# EAGLE design Logic Engine - AVR (EAGLE 7.4.0)
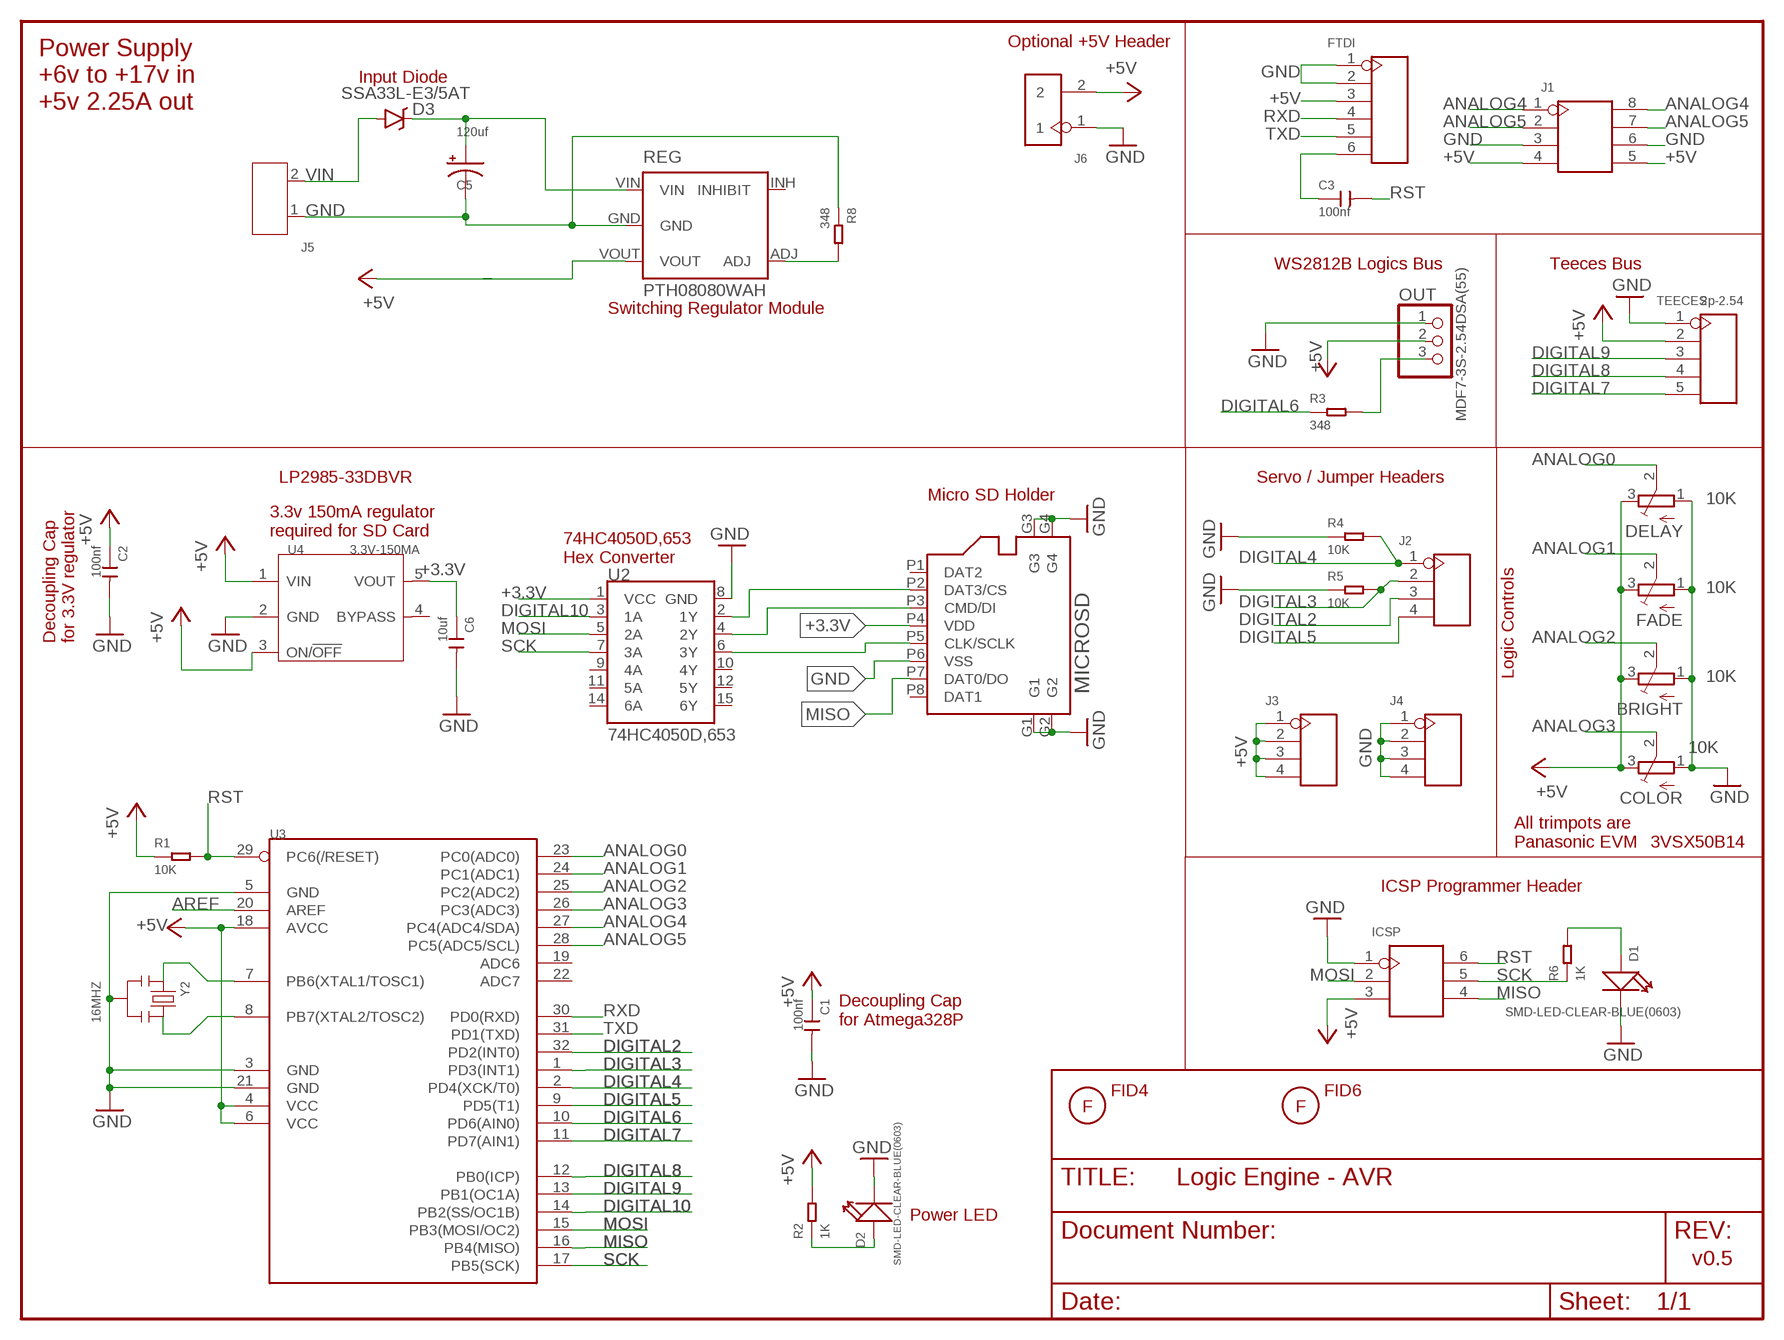
[diagram p0: schematic, sheet 1]

## Parts
BRIGHT  10K  TRIMPOTEVM3V  [EVM3V]
C1  100nf  CERAMIC-100NF-50V-10%-X7R(0805)  [C0805]
C2  100nf  CERAMIC-100NF-50V-10%-X7R(0805)  [C0805]
C3  100nf  CERAMIC-100NF-50V-10%-X7R(0805)  [C0805]
C5  120uf  CPOL-USD  [PANASONIC_D]
C6  10uf  CERAMIC-10UF-25V-10%-X5R(0805)  [C0805]
COLOR  10K  TRIMPOTEVM3V  [EVM3V]
D1  SMD-LED-CLEAR-BLUE(0603)  [LED-0603]
D2  SMD-LED-CLEAR-BLUE(0603)  [LED-0603]
D3  SSA33L-E3/5AT  B340A  [SMA-DIODE]
DELAY  10K  TRIMPOTEVM3V  [EVM3V]
FADE  10K  TRIMPOTEVM3V  [EVM3V]
FID4  FIDUCIAL  [FIDUCIAL_G15]
FID6  FIDUCIAL  [FIDUCIAL_G15]
FTDI  DIP-BLACK-MALE-HEADER(6P-2.54)  [H6-2.54]
ICSP  DIP-BLACK-MALE-HEADER(2X3P-2.54）-2.54  [H2X3-2.54]
J1  DIP-BLACK-MALE-HEADER-VERT(2X4P-2.54)  [H2X4-2.54]
J2  DIP-BLACK-MALE-HEADER-VERT(4P-2.54)  [H4-2.54]
J3  DIP-BLACK-MALE-HEADER-VERT(4P-2.54)  [H4-2.54]
J4  DIP-BLACK-MALE-HEADER-VERT(4P-2.54)  [H4-2.54]
J5  SCREW-TERMINAL-GREEN(2P-3.5)  [H2-3.5-7.0X7.0MM]
J6  DIP-BLACK-MALE-HEADER-VERT(2P-2.54)  [H2-2.54]
MICROSD  MICROSD47579-001  [SD-47579-001]
OUT  MDF7-3S-2.54DSA(55)  MDF7-1X3  [MDF7_1X03]
R1  10K  RES-0603  [R0603]
R2  1K  RES-0603  [R0603]
R3  348  RES-0603  [R0603]
R4  10K  RES-0603  [R0603]
R5  10K  RES-0603  [R0603]
R6  1K  RES-0603  [R0603]
R8  348  RES-0603  [R0603]
REG  PTH08080WAH  PTH08080WPTH08080W_TH  [PTH08080W_TH]
TEECES  2p-2.54  DIP-BLACK-MALE-HEADER-VERT(5P-2.54)  [H5-2.54]
U2  74HC4050D,653  HEX_CONVERTER  [SO016]
U3  MCU-ATMEGA328P-AU(TQFP32)  [TQFP32-0.8-7X7MM]
U4  3.3V-150MA  PMIC-LP2985-50DBVR(SOT23-5)  [SOT-23-5]
Y2  16MHZ  SMD-RESONATOR-16MHZ-15PF-0.5%-40R(3P-3.2X1.3MM)  [X3-SMD-3.6X1.3X0.8MM]

## Nets
+3.3V: C6.1 MICROSD.P4(VDD) U2.1(VCC) U4.5(VOUT)
+5V [supply]: BRIGHT.3(E) C1.1 C2.1 COLOR.3(E) DELAY.3(E) FADE.3(E) FTDI.3 ICSP.3 J1.4 J1.5 J3.1 J3.2 J3.3 J3.4 J6.2 OUT.2 R1.1 R2.2 REG.VOUT TEECES.2 U3.4(VCC) U3.6(VCC) U3.18(AVCC) U4.1(VIN) U4.3(ON/!OFF)
ANALOG0: DELAY.2(S) U3.23(PC0(ADC0))
ANALOG1: FADE.2(S) U3.24(PC1(ADC1))
ANALOG2: BRIGHT.2(S) U3.25(PC2(ADC2))
ANALOG3: COLOR.2(S) U3.26(PC3(ADC3))
ANALOG4: J1.1 J1.8 U3.27(PC4(ADC4/SDA))
ANALOG5: J1.2 J1.7 U3.28(PC5(ADC5/SCL))
AREF: U3.20(AREF)
CS: MICROSD.P2(DAT3/CS) U2.2(1Y)
DATA_IN: MICROSD.P3(CMD/DI) U2.4(2Y)
DIGITAL2: J2.3 U3.32(PD2(INT0))
DIGITAL3: J2.2 R5.2 U3.1(PD3(INT1))
DIGITAL4: J2.1 R4.2 U3.2(PD4(XCK/T0))
DIGITAL5: J2.4 U3.9(PD5(T1))
DIGITAL6 [LED_out]: R3.1 U3.10(PD6(AIN0))
DIGITAL7: TEECES.5 U3.11(PD7(AIN1))
DIGITAL8: TEECES.4 U3.12(PB0(ICP))
DIGITAL9: TEECES.3 U3.13(PB1(OC1A))
DIGITAL10: U2.3(1A) U3.14(PB2(SS/OC1B))
GND [beefyPower]: BRIGHT.1(A) C1.2 C2.2 C5.- C6.2 COLOR.1(A) D1.- D2.- DELAY.1(A) FADE.1(A) FTDI.1 FTDI.2 ICSP.1 J1.3 J1.6 J4.1 J4.2 J4.3 J4.4 J5.1 J6.1 MICROSD.G1 MICROSD.G2 MICROSD.G3 MICROSD.G4 MICROSD.P6(VSS) OUT.1 R4.1 R5.1 R8.1 REG.GND TEECES.1 U2.8(GND) U3.3(GND) U3.5(GND) U3.21(GND) U4.2(GND) Y2.2
MISO: ICSP.4 MICROSD.P7(DAT0/DO) U3.16(PB4(MISO))
MOSI: ICSP.2 U2.5(2A) U3.15(PB3(MOSI/OC2))
N$3 [beefyPower]: C5.+ D3.C REG.VIN
N$4: D1.+ R6.2
N$5 [supply]: D2.+ R2.1
N$6: R8.2 REG.ADJ
N$7: OUT.3 R3.2
N$9: U3.7(PB6(XTAL1/TOSC1)) Y2.1
N$10: U3.8(PB7(XTAL2/TOSC2)) Y2.3
RST: C3.2 ICSP.6 R1.2 U3.29(PC6(/RESET))
RTS#: C3.1 FTDI.6
RXD: FTDI.4 U3.30(PD0(RXD))
SCK: ICSP.5 R6.1 U2.7(3A) U3.17(PB5(SCK))
SCLK: MICROSD.P5(CLK/SCLK) U2.6(3Y)
TXD: FTDI.5 U3.31(PD1(TXD))
VIN [beefyPower]: D3.A J5.2
Unconnected: MICROSD.P1(DAT2) MICROSD.P8(DAT1) REG.INH(INHIBIT) U2.9(4A) U2.10(4Y) U2.11(5A) U2.12(5Y) U2.14(6A) U2.15(6Y) U3.19(ADC6) U3.22(ADC7) U4.4(BYPASS)

## Notes on the sheet
- Optional +5V Header
- Input Diode
- Power Supply
  +6v to +17v in
  +5v 2.25A out
- WS2812B Logics Bus | Teeces Bus
- Switching Regulator Module
- LP2985-33DBVR | Servo / Jumper Headers
- Micro SD Holder
- 3.3v 150mA regulator
  required for SD Card
- 74HC4050D,653
  Hex Converter
- Decoupling Cap
  for 3.3V regulator
- Logic Controls
- All trimpots are
  Panasonic EVM‑3VSX50B14
- ICSP Programmer Header
- Decoupling Cap
  for Atmega328P
- Power LED
- v0.5

## Library data of the parts
BRIGHT COLOR DELAY FADE = rseries:TRIMPOT: Panasonic SMT trimmer potentiometer part number EVM3V http://industrial.panasonic.com/www-data/pdf/AOI0000/AOI0000CE4.pdf
C1-C3 = Seeed-OPL-Capacitor:CERAMIC-100NF-50V-10%-X7R(0805): 302010165; MPN: CC0805KRX7R9BB104
C5 = rseries:CPOL-US: POLARIZED CAPACITOR, American symbol
C6 = Seeed-OPL-Capacitor:CERAMIC-10UF-25V-10%-X5R(0805): 302010178; MPN: CC0805KKX5R8BB106
D1 D2 = OPL-Diode:SMD-LED-CLEAR-BLUE(0603): 304090045; MPN: 19-217-BHC-ZL1M2RY-3T
D3 = SparkFun-DiscreteSemi:B340A: Schottky Diode 3A-40V; PROD_ID: DIO-09886; VALUE: BA340A
FID4 FID6 = SmallBatchLibPre1:FIDUCIAL
FTDI = Seeed-OPL-Connector:DIP-BLACK-MALE-HEADER(6P-2.54): 320020078; MPN: P125-1106A1BS116A1
ICSP = Seeed-OPL-Connector:DIP-BLACK-MALE-HEADER(2X3P-2.54）: 320020077; MPN: P125-12A1BS116A1
J1 = OPL-Connector:DIP-BLACK-MALE-HEADER-VERT(2X4P-2.54): 320020029; MPN: P125-1208A0BS116A2
J2-J4 = OPL-Connector:DIP-BLACK-MALE-HEADER-VERT(4P-2.54): 320020017; MPN: P125-1104A0BS116A1
J5 = OPL-Connector:SCREW-TERMINAL-GREEN(2P-3.5): 320110028
J6 = OPL-Connector:DIP-BLACK-MALE-HEADER-VERT(2P-2.54): 320020016; MPN: P125-1102A0BS116A1
MICROSD = rseries:MICROSD: Micro-SD / Transflash card holder with SPI pinout For the Molex 0473093751 small-footprint MicroSD holder.
OUT = rseries:MDF7-1X3: MDF7 Bottom Entry Receptacle
R1 R2 R4-R6 = OPL-Resistor:RES
R3 R8 = Seeed-OPL-Resistor:RES
REG = rseries:PTH08080W
TEECES = Seeed-OPL-Connector:DIP-BLACK-MALE-HEADER-VERT(5P-2.54): 320020040
U2 = SparkFun-DigitalIC:HEX_CONVERTER: Just what it says.
U3 = Seeed-OPL-ic:MCU-ATMEGA328P-AU(TQFP32): 310010049; MPN: ATMEGA328P-AU
U4 = Seeed-OPL-ic:PMIC-LP2985-50DBVR(SOT23-5): 310030254; MPN: LP2985-33DBVR; VALUE: 5V-150MA
Y2 = Seeed-OPL-crystal-osctllator:SMD-RESONATOR-16MHZ-15PF-0.5%-40R(3P-3.2X1.3MM): 306030002; MPN: CSTCE16M0V53-R0

## Net classes
1 supply: width 0.305 mm, drill 0.152 mm, clearance 0.203 mm
2 LED_out: width 0.305 mm, clearance 0.229 mm
3 beefyPower: width 1.676 mm, clearance 0.33 mm

## Board
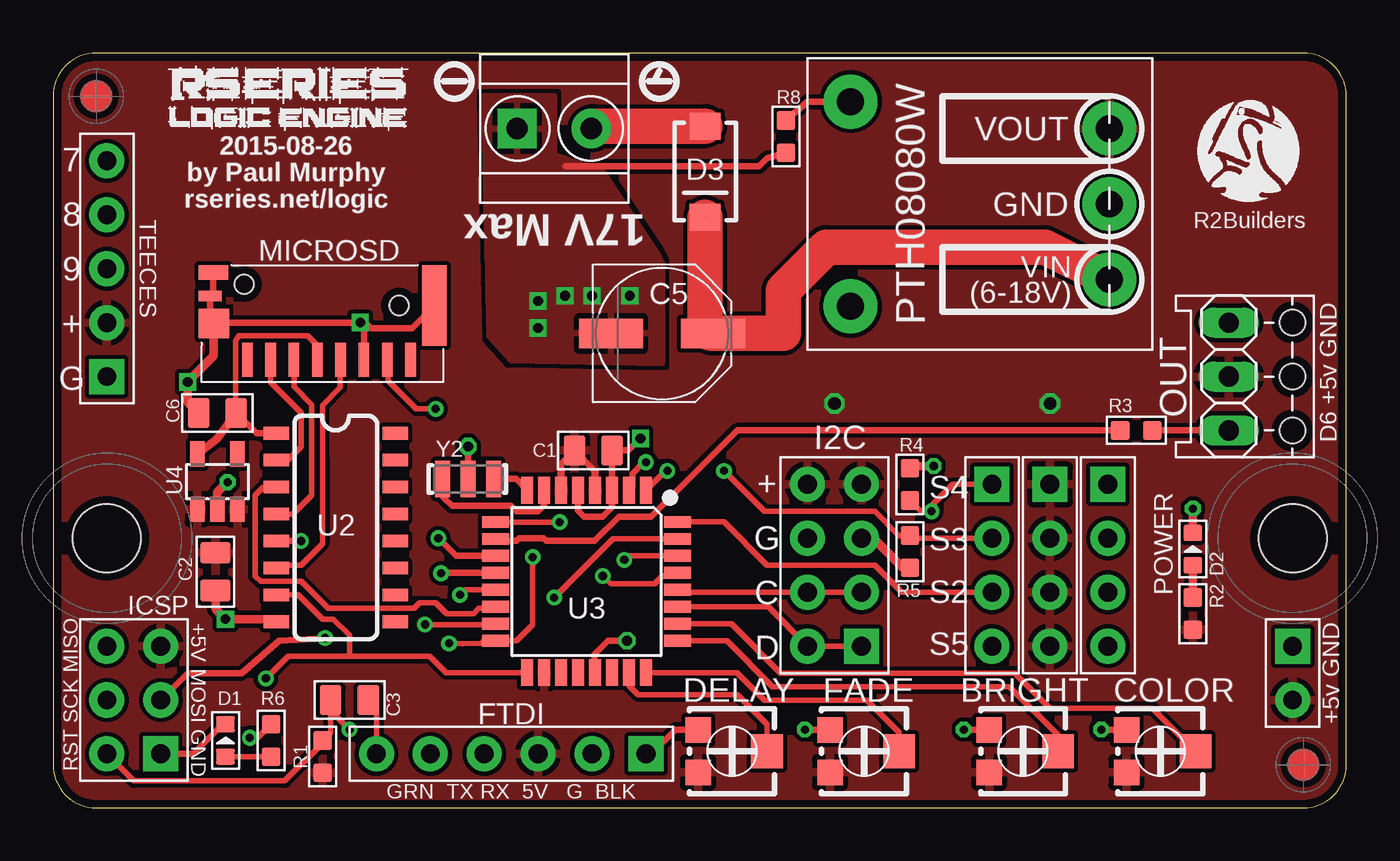
[diagram p1: board, top side]
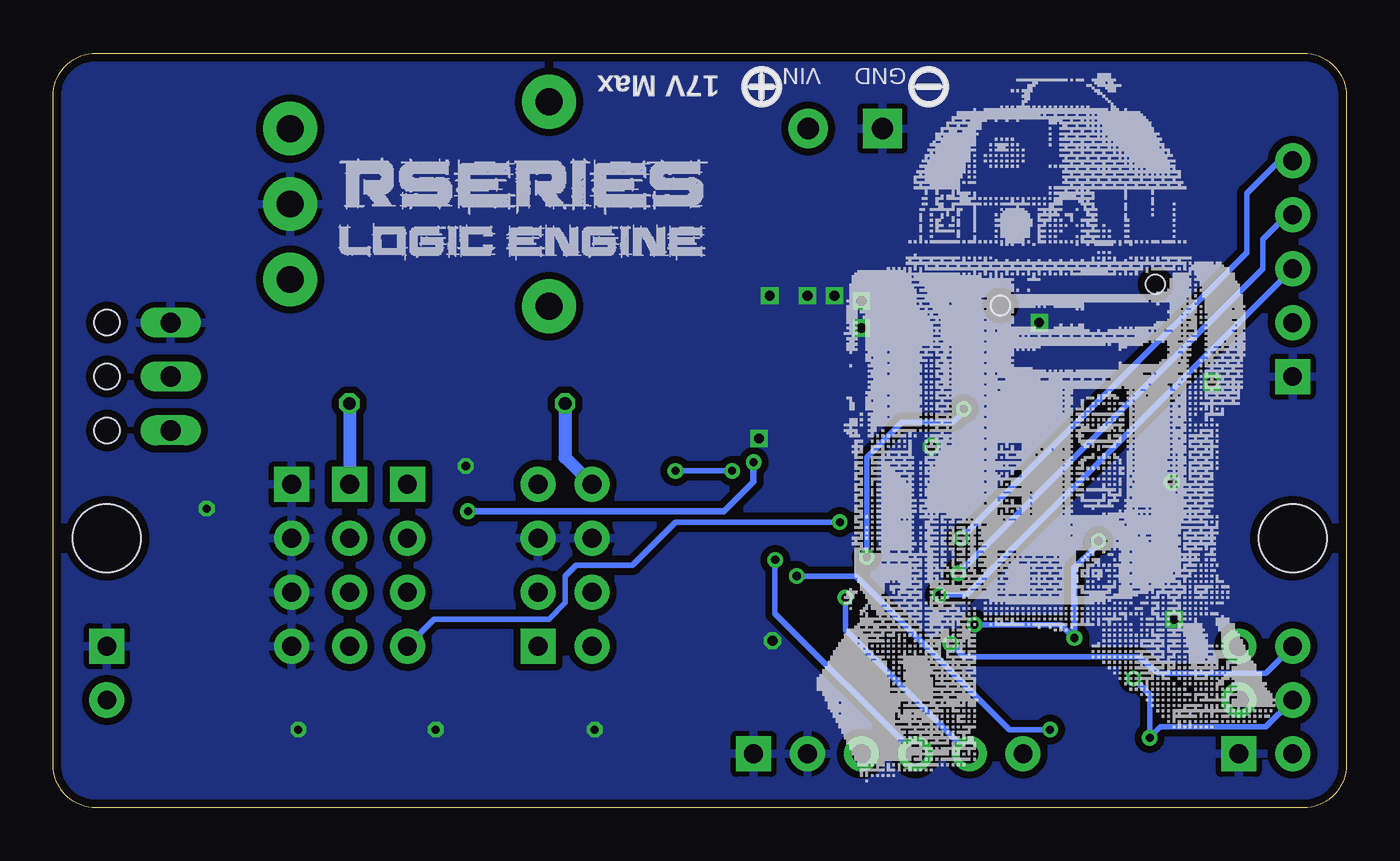
[diagram p2: board, bottom side, seen from below]

Size 60.96 x 35.56 mm. Coordinates in mm from the lower left corner, seen from the top.
Outline: 60.96,2.03 60.96,33.53 arc90 58.93,35.56 2.03,35.56 arc90 0,33.53 0,2.03 arc90 2.03,0 58.93,0 arc90 60.96,2.03
Copper layers (1*16): Top 0.0356mm / dielectric 1.5011mm / Bottom 0.0356mm
Design rules "LaenPCBOrder *": minimum track width 10mil, minimum drill 13mil, track to track 6mil, track to pad 6mil, pad to pad 6mil, via to via 12mil, smd to smd 6mil, copper to edge 15mil, drill to drill 6mil, minimum pad ring 7mil, minimum via ring 7mil, stop-mask expansion 4mil, vias tented up to drill 24mil, thermal gap 10mil
Holes 3.2 mm at 58.42,12.7 2.54,12.7
tRestrict: area 21.5,7 to 28.8,14.4

### Footprints (pad centres in the part's own frame; a part is rotated, then mirrored left to right if it is on the bottom)
EVM3V = smd 1.2 x 1.2: 1 -1,-1.6; 3 1,-1.6 | smd 1.6 x 1.5: 2 0,1.65
C0805 = smd 1.397 x 1.016: 1 0,0.889; 2 0,-0.889
PANASONIC_D = smd 3 x 1.4: + 2.4,0; - -2.4,0
LED-0603 = smd 0.762 x 0.889: + -0.762,0; - 0.762,0
SMA-DIODE = smd 1.27 x 1.47: A -2.15,0; C 2.15,0
H6-2.54 = drill 0.889 pad 1.651 square: 1 0,6.35 | drill 0.889 pad 1.651: 2 0,3.81; 3 0,1.27; 4 0,-1.27; 5 0,-3.81; 6 0,-6.35
H2X3-2.54 = drill 0.889 pad 1.651 square: 1 -1.27,2.54 | drill 0.889 pad 1.651: 2 -1.27,0; 3 -1.27,-2.54; 4 1.27,-2.54; 5 1.27,0; 6 1.27,2.54
H2X4-2.54 = drill 0.889 pad 1.651 square: 1 -1.27,3.81 | drill 0.889 pad 1.651: 2 -1.27,1.27; 3 -1.27,-1.27; 4 -1.27,-3.81; 5 1.27,-3.81; 6 1.27,-1.27; 7 1.27,1.27; 8 1.27,3.81
H4-2.54 = drill 0.889 pad 1.651 square: 1 0,3.81 | drill 0.889 pad 1.651: 2 0,1.27; 3 0,-1.27; 4 0,-3.81
H2-3.5-7.0X7.0MM = drill 1 pad 1.85 square: 1 -1.75,0 | drill 1 pad 1.85: 2 1.75,0
H2-2.54 = drill 0.889 pad 1.651 square: 1 0,1.27 | drill 0.889 pad 1.651: 2 0,-1.27
SD-47579-001 = smd 1.15 x 3.8: G1 -4.975,-3.35 | smd 1.45 x 1.4: G2 5.425,-2.5 | smd 1.1 x 0.5: G3 5.6,-3.8 | smd 1.4 x 0.7: G4 5.45,-4.9 | smd 0.5 x 1.6: P1 3.85,-0.8; P2 2.75,-0.8; P3 1.65,-0.8; P4 0.55,-0.8; P5 -0.55,-0.8; P6 -1.65,-0.8; P7 -2.75,-0.8; P8 -3.85,-0.8 | hole 0.9: -3.3,-3.35; 4,-4.35
MDF7_1X03 = drill 0.95 long: 1 -2.54,0; 2 0,0; 3 2.54,0 | hole 1.2: 0,3; 2.54,3; -2.54,3
R0603 = smd 0.889 x 0.889: 1 0,0.762; 2 0,-0.762
PTH08080W_TH = drill 1.27 pad 2.54: ADJ 6.096,-4.826; GND -6.096,0; INH 6.096,4.826; VIN -6.096,3.556; VOUT -6.096,-3.556
H5-2.54 = drill 0.889 pad 1.651 square: 1 0,5.08 | drill 0.889 pad 1.651: 2 0,2.54; 3 0,0; 4 0,-2.54; 5 0,-5.08
SO016 = smd 0.6 x 1.2: 1 -4.445,-2.8; 2 -3.175,-2.8; 3 -1.905,-2.8; 4 -0.635,-2.8; 5 0.635,-2.8; 6 1.905,-2.8; 7 3.175,-2.8; 8 4.445,-2.8; 9 4.445,2.8; 10 3.175,2.8; 11 1.905,2.8; 12 0.635,2.8; 13 -0.635,2.8; 14 -1.905,2.8; 15 -3.175,2.8; 16 -4.445,2.8
TQFP32-0.8-7X7MM = smd 1.27 x 0.559: 1 -4.293,2.8; 2 -4.293,2; 3 -4.293,1.2; 4 -4.293,0.4; 5 -4.293,-0.4; 6 -4.293,-1.2; 7 -4.293,-2; 8 -4.293,-2.8; 17 4.293,-2.8; 18 4.293,-2; 19 4.293,-1.2; 20 4.293,-0.4; 21 4.293,0.4; 22 4.293,1.2; 23 4.293,2; 24 4.293,2.8 | smd 0.559 x 1.27: 9 -2.8,-4.293; 10 -2,-4.293; 11 -1.2,-4.293; 12 -0.4,-4.293; 13 0.4,-4.293; 14 1.2,-4.293; 15 2,-4.293; 16 2.8,-4.293; 25 2.8,4.293; 26 2,4.293; 27 1.2,4.293; 28 0.4,4.293; 29 -0.4,4.293; 30 -1.2,4.293; 31 -2,4.293; 32 -2.8,4.293
SOT-23-5 = smd 0.69 x 1.2: 1 -0.95,-1.3; 2 0,-1.3; 3 0.95,-1.3; 4 0.95,1.3; 5 -0.95,1.3
X3-SMD-3.6X1.3X0.8MM = smd 0.7 x 1.7: 1 -1.2,0; 2 0,0; 3 1.2,0

### Placement (x,y rotation side)
BRIGHT  45.72,2.67 270 top
C1  25.46,16.84 90 top
C2  7.66,11.13 0 top
C3  13.97,5.08 270 top
C5  28.7,22.35 0 top
C6  7.75,18.61 270 top
COLOR  52.2,2.67 270 top
D1  8.13,3.17 90 top
D2  53.72,12.19 90 top
D3  30.73,29.97 270 top
DELAY  32,2.67 270 top
FADE  38.23,2.67 270 top
FID4  2.03,33.53 0 top
FID6  58.93,2.03 0 top
FTDI  21.59,2.54 270 top
ICSP  3.81,5.08 180 top
J1  36.83,11.43 180 top
J2  44.26,11.43 0 top
J3  46.99,11.43 0 top
J4  49.72,11.43 0 top
J5  23.62,32 0 top
J6  58.42,6.35 0 top
MICROSD  13,20.32 180 top
OUT  55.42,20.32 270 top
R1  12.7,2.41 180 top
R2  53.72,9.14 0 top
R3  51.05,17.78 90 top
R4  40.39,15.24 0 top
R5  40.39,12.06 180 top
R6  10.29,3.17 0 top
R8  34.54,31.62 180 top
REG  43.69,28.45 180 top
TEECES  2.54,25.4 180 top
U2  13.34,13.21 270 top
U3  25.15,10.67 270 top
U4  7.75,15.37 0 top
U$1  [R2BUILDERS-LOGO]  53.85,28.45 0 top
U$2  [RSERIES-LE-LOGO2]  11.05,33.15 0 top
U$3  [RSERIES-LE-LOGO]  38.99,27.81 0 bottom
U$4  [R2-2LEG]  14.35,5.33 0 bottom
Y2  19.56,15.49 0 top

### Tracks (layer width: path | path; a pad name or v marks a point on that pad's centre or on a via)
+3.3V
  Top 0.254: MICROSD.P4 12.46,21.78 11.99,22.25 8.75,22.25 8.61,22 8.61,18.63 C6.1
  Top 0.305: 8.64,18.57 C6.1 9.59,17.65 U2.1
  Top 0.406: U4.5 7.75,17.4 C6.1
+5V  (via drill 0.6)
  Top 0.305: U3.6 23.95,16.21 C1.1 25.55,15.87 U3.4
  Bottom 0.61: v46.99,19.05 J3.1 | v36.83,19.05 36.83,16.51 J1.5
  pour Top (rank 3): -3.56,39.24 62.36,39.24 62.36,-1.14 -3.81,-1.14
ANALOG0
  Top 0.254: U3.23 27.15,5.75 27.56,5.33 32.26,5.33 33.66,3.94 DELAY.2
ANALOG1
  Top 0.254: U3.24 32.23,6.38 33.53,5.08 38.35,5.08 39.88,3.56 FADE.2
ANALOG2
  Top 0.254: U3.25 31.76,7.87 33.91,5.71 45.09,5.71 47.37,3.43 BRIGHT.2
ANALOG3
  Top 0.254: U3.26 31.97,8.67 34.29,6.35 45.34,6.35 46.99,4.7 51.81,4.7 COLOR.2
ANALOG4
  Top 0.254: U3.27 33.71,9.47 J1.8 J1.1
ANALOG5
  Top 0.254: U3.28 29.55,10.16 J1.7 J1.2
CS
  Top 0.254: U2.2 11.05,16.38 11.68,17.02 11.68,18.29 11.68,18.62 10.26,20.05 MICROSD.P2 10.26,21.13
DATA_IN
  Top 0.254: U2.4 11.3,13.84 12.19,14.73 12.19,17.53 12.19,19 11.35,19.84 MICROSD.P3
DIGITAL2
  Top 0.254: U3.32 31.62,13.47 33.66,11.43 38.73,11.43 40.01,10.16 J2.3
DIGITAL3  (via drill 0.38)
  Top 0.254: U3.1 28.86,15.88 v28.96,15.88 | v31.62,15.88 33.53,13.97 38.73,13.97 39.88,12.83 R5.2 40.51,12.7 J2.2
  Bottom 0.254: v28.96,15.88 v31.62,15.88
DIGITAL4  (via drill 0.38)
  Top 0.254: J2.1 42.42,15.24 41.4,14.22 v41.4,13.97 40.89,13.97 R4.2
  Top 0.305: U3.2 27.3,15.12 27.3,15.75 27.81,16.26 v27.94,16.28
  Bottom 0.305: v27.94,16.28 27.94,15.37 29.34,13.97 v41.4,13.97
DIGITAL5  (via drill 0.38)
  Top 0.254: U3.9 v23.88,13.46
  Bottom 0.254: v23.88,13.46 31.62,13.46 33.66,11.43 36.32,11.43 36.83,10.92 36.83,9.65 37.59,8.89 42.99,8.89 J2.4
DIGITAL6
  Top 0.305: R3.1 32.26,17.78 28.19,13.72 26.67,13.72 25.53,12.57 23.24,12.57 23.11,12.7 21.97,12.7 21.84,12.57 20.89,12.57 U3.10
DIGITAL7  (via drill 0.38)
  Top 0.305: v18.16,12.7 18.99,11.87 U3.11
  Bottom 0.254: v18.16,12.7 4.7,26.16 4.7,28.96 3.17,30.48 TEECES.5
DIGITAL8  (via drill 0.38)
  Top 0.305: v18.29,11.05 18.43,11.07 U3.12
  Bottom 0.254: v18.29,11.05 3.94,25.4 3.94,26.8 2.79,27.94 TEECES.4
DIGITAL9  (via drill 0.38)
  Top 0.254: v19.18,10.03 19.41,10.27 U3.13
  Bottom 0.254: TEECES.3 17.91,10.03 v19.18,10.03
DIGITAL10
  Top 0.254: U2.3 9.91,15.11 9.53,14.73 9.53,10.92 9.78,10.67 11.68,10.67 12.95,9.4 17.02,9.4 17.27,9.65 18.03,9.65 18.54,9.14 18.8,9.14 19.81,9.14 20.07,9.4 20.78,9.4 | 20.78,9.4 U3.14 20.78,9.4
GND  (via drill 0.38, 0.46)
  Top 0.305: 24.16,30.23 33.27,30.23 33.66,30.61 R8.1 | U3.5 24.75,13.99 25.02,13.72 25.91,13.72 26.35,14.15 U3.3 C1.2 27.13,16.84 v27.69,17.4 | Y2.2 v19.56,17.02 | U3.21 25.53,6.39 25.53,7.24 26.16,7.87 v27.05,7.87 | FTDI.1 28.19,2.54 29.34,3.68 30.39,3.68 DELAY.1 | C6.2 6.77,18.7 | ICSP.1 6.6,2.54 8,3.94 D1.- | FADE.1 v35.43,3.68 | BRIGHT.1 v42.93,3.68 | COLOR.1 v49.4,3.68 | MICROSD.G4 7.55,24.27 MICROSD.G3 7.41,23 MICROSD.G2 7.62,22.86 v14.48,22.86 | v14.48,22.86 14.65,22.68 MICROSD.P6 | MICROSD.G1 16.92,22.61 14.99,22.61 14.73,22.86 v14.48,22.86
  Top 0.406: C2.2 7.66,9.36 v8.13,8.89 10.41,8.89 U2.8 | D2.- v53.72,14.1 | R4.1 40.49,16.1 v41.5,16.1 | R5.1 40.06,11.3 38.66,12.7 J1.3 | U4.2 7.75,14.86 v8.23,15.34 | C6.2 6.35,19.11 v6.35,20.07 7.58,21.3 MICROSD.G2
  Top 0.813: REG.GND 49.91,28.57
  other vias: 22.86,22.61 24.13,24.13 27.18,24.13 25.4,24.13 22.86,23.88
  pour Bottom (rank 5): -2.16,37.85 63.63,37.85 63.63,-2.29 -2.16,-2.29
  pour Top: 28.7,20.95 28.7,25.65 28.45,26.16 25.91,29.97 23.62,30.73 23.62,33.53 20.32,33.53 20.57,22.23 21.59,21.08
MISO  (via drill 0.38)
  Top 0.254: v18.67,7.75 19.31,7.74 20.19,7.75 20.31,7.87 U3.16 21.71,7.87 21.72,7.87 21.84,7.87 22.61,8.64 v22.61,11.81 | MICROSD.P7 15.8,21.08 15.8,20.12 17.12,18.8 v18.03,18.8
  Bottom 0.254: ICSP.4 3.81,6.35 8.89,6.35 9.78,7.11 13.97,7.11 18.03,7.11 v18.67,7.75 | v22.61,11.81 22.61,16.51 20.95,18.16 18.54,18.16 18.03,18.67 v18.03,18.8
MOSI  (via drill 0.38)
  Top 0.254: 20.76,8.64 v17.53,8.64
  Top 0.305: U3.15 20.76,8.64 | v11.68,12.57 U2.5 | ICSP.2 6.35,6.35 8.89,6.35 10.67,7.87 v12.83,8
  Bottom 0.254: v17.53,8.64 13.46,8.64 v12.83,8
  Bottom 0.305: v11.68,12.57 11.94,12.19 12.83,11.3 v12.83,8
N$3  (1 unrouted)
  Top 1.676: REG.VIN 46.74,26.42 36.45,26.42 34.42,24.38 34.42,22.35 C5.+ | 31.24,22.35 C5.+ | C5.+ arc-90 30.73,22.72 D3.C
N$4
  Top 0.254: R6.2 D1.+
N$5
  Top 0.406: R2.1 D2.+
N$6
  Top 0.305: R8.2 35.56,33.27 REG.ADJ
N$7
  Top 0.305: R3.2 OUT.3
N$9
  Top 0.305: Y2.1 18.41,15.44 18.41,14.61 18.8,14.22 21.59,14.22 21.84,13.97 22.86,13.97 23.15,14.26 U3.7
N$10
  Top 0.305: Y2.3 21.81,15.49 U3.8
RST  (via drill 0.38)
  Top 0.254: ICSP.6 3.81,1.27 10.92,1.27 12.7,3.05 R1.2 13.08,3.56 C3.2 13.08,4.57 v13.97,3.68 | v25.91,10.92 26.31,10.56 28.34,10.56 28.7,10.92 U3.29
  Bottom 0.254: v25.91,10.92 23.11,10.92 15.88,3.68 v13.97,3.68
RTS#
  Top 0.254: C3.1 15.24,4.45 FTDI.6
RXD  (via drill 0.38)
  Top 0.254: v26.92,11.68 27.11,11.87 U3.30
  Bottom 0.254: FTDI.4 26.92,9.14 v26.92,11.68
SCK  (via drill 0.38)
  Top 0.254: 10.66,9.91 U2.7 11.56,10.03 12.7,8.89 13.21,8.89 13.97,8.13 13.97,7.14 | U3.17 18.52,6.38 17.75,7.14 13.97,7.14 | 13.97,7.14 11.07,7.14 v10.03,6.1 | v9.27,3.3 9.65,3.3 R6.1
  Bottom 0.254: ICSP.5 3.81,3.81 8.76,3.81 v9.27,3.3 9.27,5.33 v10.03,6.1
SCLK
  Top 0.254: U2.6 10.66,11.43 11.68,11.43 12.7,12.45 12.7,16.51 12.7,18.97 13.54,19.81 13.54,21.1 MICROSD.P5
TXD  (via drill 0.38)
  Top 0.254: U3.31 26.38,12.67 v23.62,9.91
  Bottom 0.254: v23.62,9.91 23.62,8.38 FTDI.5
VIN
  Top 1.676: J5.2 arc-90 25.49,32.12 D3.A

### Text on the board
tPlace: 2015-08-26 / by Paul Murphy / rseries.net/logic | R2Builders | 17V Max | 7 / 8 / 9 / + / G | D6 +5v GND | I2C | POWER | + / G / C / D | S4 / S3 / S2 / S5 | +5v GND | RST SCK MISO | +5V MOSI GND | GRN TX RX 5V G BLK
bPlace: GND | VIN | 17V Max